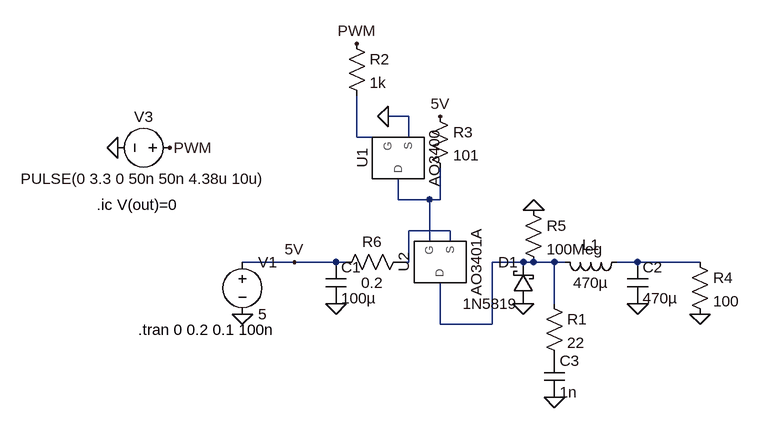
[diagram p0: schematic opamp2.asc]
opamp2.asc, the LTspice schematic file:
Version 4.1
SHEET 1 880 1292
WIRE 288 -80 256 -80
WIRE 208 -48 208 -112
WIRE 256 -48 208 -48
WIRE 288 -48 288 -80
WIRE 272 48 272 16
WIRE 320 48 272 48
WIRE 336 48 336 0
WIRE 336 48 320 48
WIRE 352 96 288 96
WIRE 320 112 320 48
WIRE 352 112 352 96
WIRE 112 144 32 144
WIRE 176 144 112 144
WIRE 192 144 176 144
WIRE 288 144 288 96
WIRE 288 144 272 144
WIRE 464 144 416 144
WIRE 480 144 464 144
WIRE 512 144 480 144
WIRE 528 144 512 144
WIRE 640 144 608 144
WIRE 736 144 640 144
WIRE 512 208 512 144
WIRE 336 240 336 176
WIRE 416 240 416 144
WIRE 416 240 336 240
FLAG 32 224 0
FLAG 464 208 0
FLAG 640 208 0
FLAG 112 144 5V
FLAG 736 224 0
FLAG -160 -32 0
FLAG 512 352 0
FLAG 208 -192 PWM
FLAG -80 -32 PWM
FLAG 336 -80 5V
FLAG 256 -80 0
FLAG 480 64 0
FLAG 176 208 0
SYMBOL voltage 32 128 R0
WINDOW 123 0 0 Left 0
WINDOW 39 0 0 Left 0
SYMATTR InstName V1
SYMATTR Value 5
SYMBOL cap 160 144 R0
SYMATTR InstName C1
SYMATTR Value 100µ
SYMBOL schottky 480 208 R180
WINDOW 0 24 64 Left 2
WINDOW 3 24 0 Left 2
SYMATTR InstName D1
SYMATTR Value 1N5819
SYMBOL ind 624 128 R90
WINDOW 0 5 56 VBottom 2
WINDOW 3 32 56 VTop 2
SYMATTR InstName L1
SYMATTR Value 470µ
SYMBOL cap 624 144 R0
SYMATTR InstName C2
SYMATTR Value 470µ
SYMATTR SpiceLine Rser=0.05
SYMBOL voltage -64 -32 R90
WINDOW 0 -32 56 VBottom 2
WINDOW 3 32 56 VTop 2
WINDOW 123 0 0 Left 0
WINDOW 39 0 0 Left 0
SYMATTR InstName V3
SYMATTR Value PULSE(0 3.3 0 50n 50n 4.38u 10u)
SYMBOL res 720 128 R0
SYMATTR InstName R4
SYMATTR Value 100
SYMBOL res 496 192 R0
SYMATTR InstName R1
SYMATTR Value 22
SYMBOL cap 496 288 R0
SYMATTR InstName C3
SYMATTR Value 1n
SYMBOL res 192 -208 R0
SYMATTR InstName R2
SYMATTR Value 1k
SYMBOL res 320 -96 R0
SYMATTR InstName R3
SYMATTR Value 101
SYMBOL spice\\AO3400 272 -16 R270
SYMATTR InstName U1
SYMBOL spice\\AO3401A_L 336 144 R270
SYMATTR InstName U2
SYMBOL res 464 48 R0
SYMATTR InstName R5
SYMATTR Value 100Meg
SYMBOL res 288 128 R90
WINDOW 0 0 56 VBottom 2
WINDOW 3 32 56 VTop 2
SYMATTR InstName R6
SYMATTR Value 0.2
TEXT -128 248 Left 2 !.tran 0 0.2 0.1 100n
TEXT -192 56 Left 2 !.ic V(out)=0

The netlist it stands for:
* opamp2.asc
V1 5V 0 5
C1 5V 0 100µ
D1 0 N004 1N5819
L1 N005 N004 470µ
C2 N005 0 470µ Rser=0.05
V3 PWM 0 PULSE(0 3.3 0 50n 50n 4.38u 10u)
R4 N005 0 100
R1 N004 P001 22
C3 P001 0 1n
R2 PWM N001 1k
R3 5V N002 101
X§U1 N002 N001 0 AO3400  ; pins D G S
X§U2 N004 N002 N003 AO3401A  ; pins D G S
R5 0 N004 100Meg
R6 N003 5V 0.2
.model D D
.lib standard.dio
.tran 0 0.2 0.1 100n
.ic V(out)=0
.lib C:\Users\usnam\Documents\GitHub\SPRO4\Hardware\precond\spice\AO3400.lib
.lib C:\Users\usnam\Documents\GitHub\SPRO4\Hardware\precond\spice\AO3401A.mod
.backanno
.end